# EAGLE design vantablack v4 programmer (EAGLE 9.6.2)
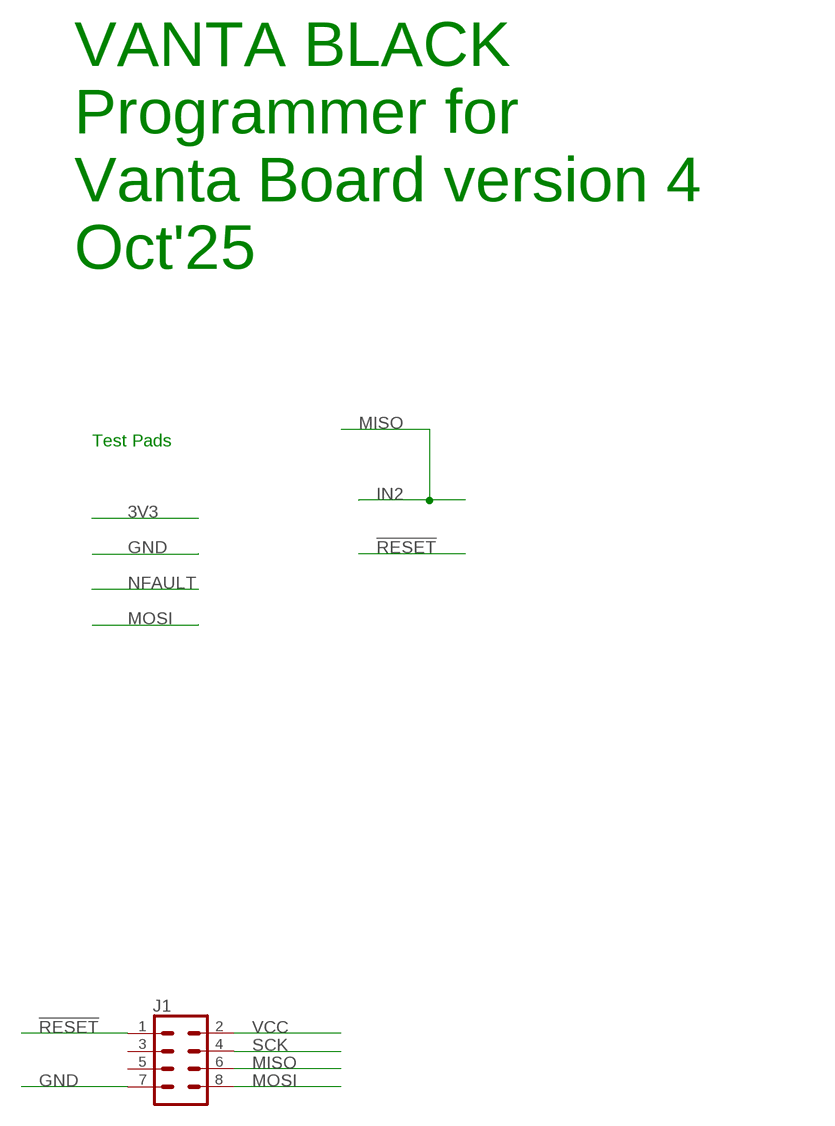
[diagram p0: schematic, sheet 1]

## Parts
J1  CONN_04X2  [2X4]

## Nets
!RESET: J1.1
GND: J1.7
MISO: J1.6
MOSI: J1.8
SCK: J1.4
VCC: J1.2
Unconnected: J1.3 J1.5

## Notes on the sheet
- VANTA BLACK
  Programmer for
  Vanta Board version 4
  Oct'25
- Test Pads

## Library data of the parts
J1 = SparkFun-Connectors:CONN_04X2: Multi connection point. Often used as Generic Header-pin footprint for 0.1 inch spaced/style header connections On any of the 0.1 inch spaced packages, you can populate with these: Break Away Headers - Straight <https://www.sparkfun.com/products/116> (PRT-00116) Break Away Male Headers - Right Angle <https://www.sparkfun.com/products/553> (PRT-00553) Female Headers <https://www.sparkfun.com/products/115> (PRT-00115) Break Away Headers - Machine Pin <https://www.sparkfun.com/products/117> (PRT-00117) Break Away Female Headers - Swiss Machine Pin <https://www.sparkfun.com/products/743> (PRT-00743)

## Board
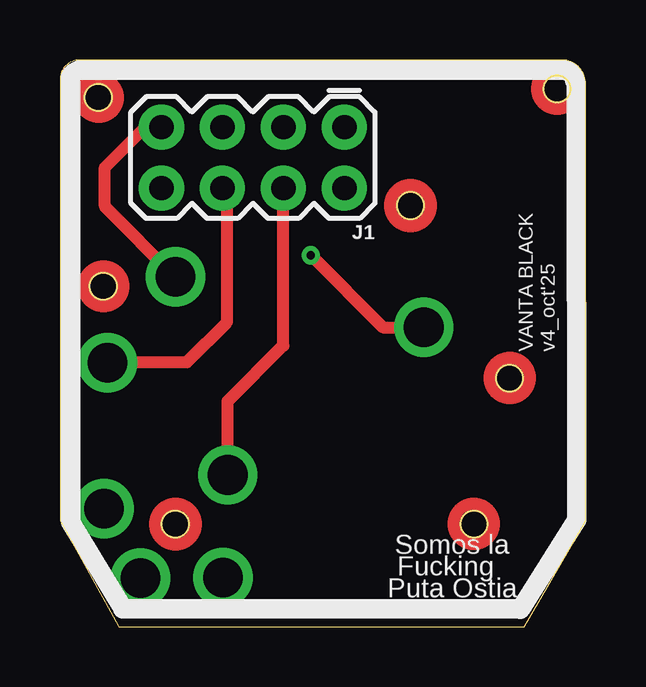
[diagram p1: board, top side]
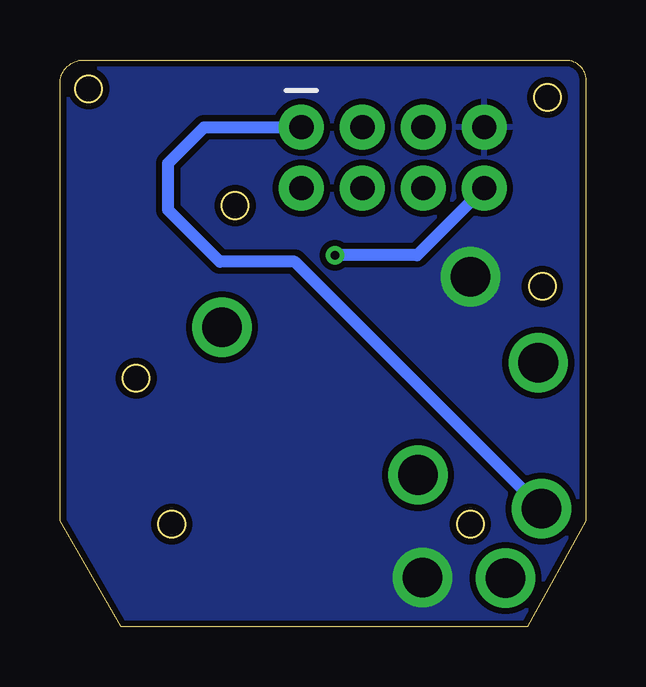
[diagram p2: board, bottom side, seen from below]

Size 21.9 x 23.63 mm. Coordinates in mm from the lower left corner, seen from the top.
Outline: 21.9,22.72 arc90 20.84,23.63 0.74,23.63 arc90 0,22.72 0,4.42 2.44,0 19.35,0 21.9,4.42 21.9,22.72
Outline: circle at 4.8,4.28 radius 0.56
Outline: circle at 17.25,4.28 radius 0.56
Outline: circle at 1.8,14.19 radius 0.56
Outline: circle at 18.73,10.36 radius 0.56
Outline: circle at 14.61,17.56 radius 0.56
Outline: circle at 1.59,22.07 radius 0.56
Outline: circle at 20.71,22.43 radius 0.56
Copper layers (1*16): Top 0.035mm / dielectric 1.5mm / Bottom 0.035mm
Design rules "default *": minimum track width 6mil, minimum drill 0.35mm, track to track 10mil, track to pad 10mil, pad to pad 10mil, via to via 10mil, smd to smd 0mil, copper to edge 1mil, drill to drill 6mil, minimum pad ring 10mil, minimum via ring 8mil, stop-mask expansion 4mil, vias tented up to drill 0mil, thermal gap 10mil
vRestrict: area 95.1,61.7 to 95.7,63

### Footprints (pad centres in the part's own frame; a part is rotated, then mirrored left to right if it is on the bottom)
2X4 = drill 1.016 pad 1.88: 1 -3.81,-1.27; 2 -3.81,1.27; 3 -1.27,-1.27; 4 -1.27,1.27; 5 1.27,-1.27; 6 1.27,1.27; 7 3.81,-1.27; 8 3.81,1.27

### Placement (x,y rotation side)
J1  8.04,19.56 180 top

### Tracks (layer width: path | path; a pad name or v marks a point on that pad's centre or on a via)
!RESET  (via drill 1.65)
  Bottom 0.508: v1.84,4.93 12.13,15.22 15.24,15.22 17.4,17.38 17.4,19.33 15.9,20.83 J1.1
GND  (via drill 1.65)
  Top 0.508: v4.81,14.59 1.87,17.53 1.87,19.15 3.55,20.83 J1.7
  other vias: 6.8,2.05
  pour Bottom (isolate 0.254): -0.4,23.71 -0.4,-0.87 22.59,-0.87 22.65,-0.81 22.65,24.16 22.5,24.31 -0.4,24.31
MISO  (via drill 1.65)
  Top 0.508: v1.98,11 2.01,11.03 5.29,11.03 6.97,12.71 6.97,18.09 J1.6
MOSI  (via drill 0.35, 1.65)
  Top 0.508: v10.45,15.49 13.46,12.48 v15.16,12.48
  Bottom 0.508: J1.8 7.03,15.49 v10.45,15.49
N$2  (via drill 1.65)
  other vias: 3.35,2.03
SCK  (via drill 1.65)
  Top 0.508: v6.99,6.33 6.99,9.4 9.31,11.72 J1.4
(copper drawn outside any net)
  shapes: Top circle x7

### Text on the board
tPlace: VANTA BLACK / v4_oct'25 | Puta Ostia
tNames: Somos la | Fucking